# Altium project SensorProject.PrjPcb
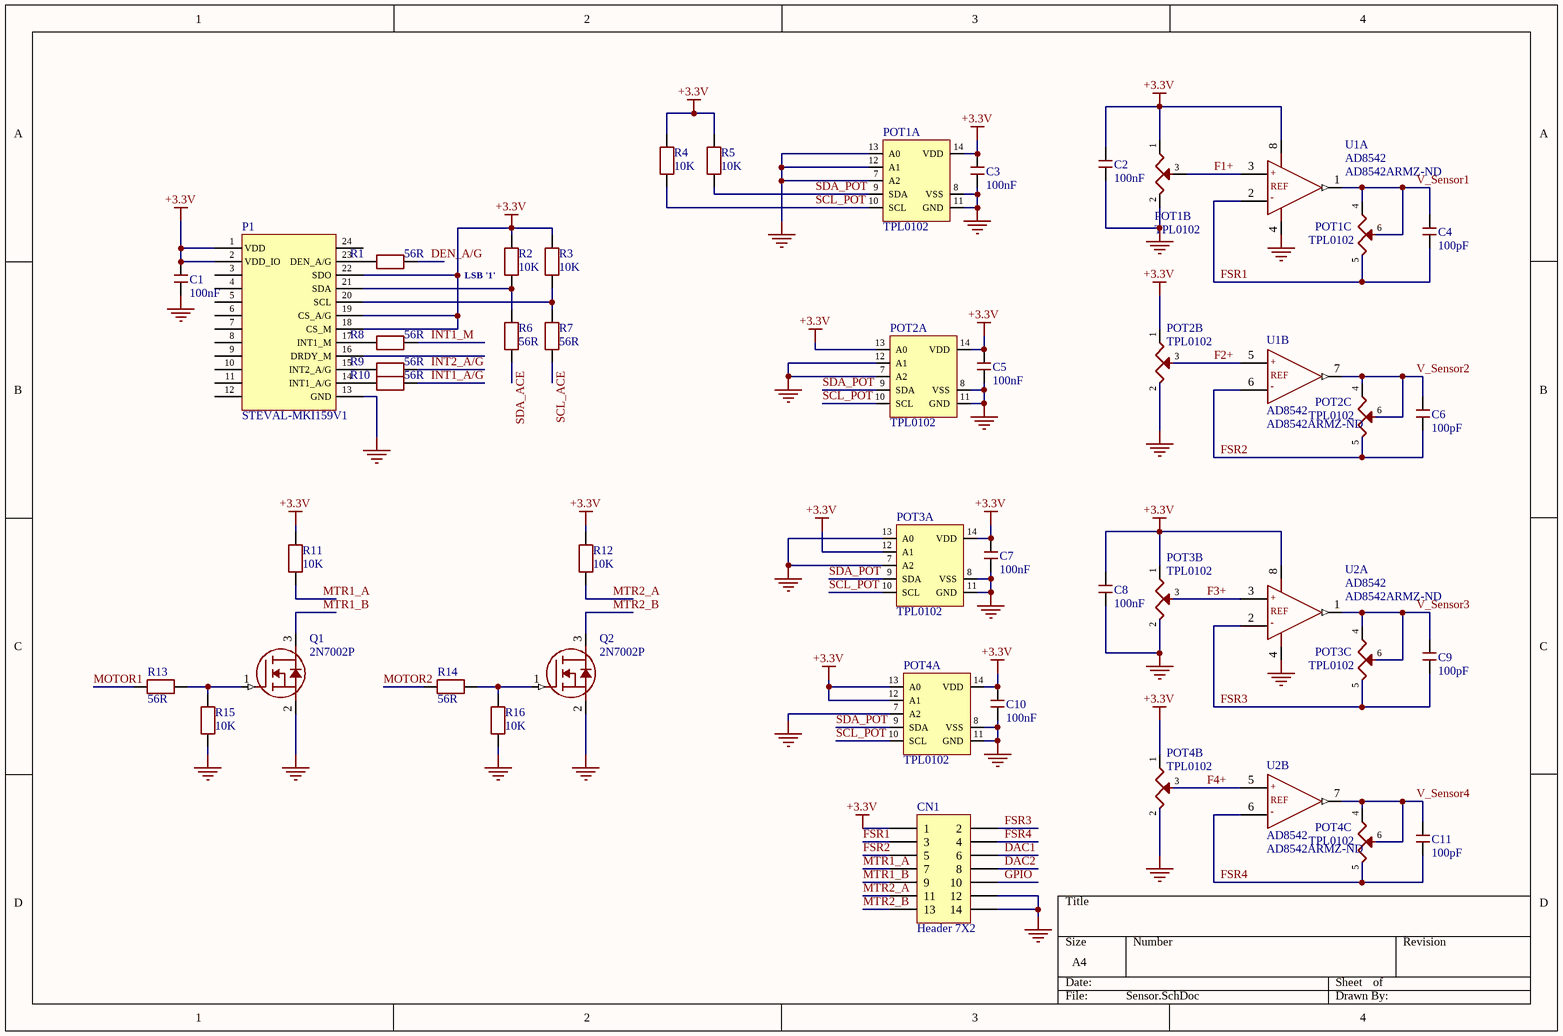
[diagram p0: Sensor.SchDoc]
2 sheets, 110 parts. Net scope: global (net labels, ports and power ports of the same name join across sheets).
Board file: PCB_REVA.PcbDoc
Sheets:
  Sensor.SchDoc
  uC.SchDoc

## Sheet Sensor.SchDoc
size A4

### Parts
C1  100nF  [CAP0805[2012]MD-BO]
C2  100nF  [CAP0805[2012]MD-BO]
C3  100nF  [CAP0805[2012]MD-BO]
C4  100pF  [CAP0805[2012]MD-BO]
C5  100nF  [CAP0805[2012]MD-BO]
C6  100pF  [CAP0805[2012]MD-BO]
C7  100nF  [CAP0805[2012]MD-BO]
C8  100nF  [CAP0805[2012]MD-BO]
C9  100pF  [CAP0805[2012]MD-BO]
C10  100nF  [CAP0805[2012]MD-BO]
C11  100pF  [CAP0805[2012]MD-BO]
CN1  Header 7X2  [HDR2X7]
P1  STEVAL-MKI159V1  [STEVAL-MKI159V1 (2)]
POT1  TPL0102  [TPL0102]  (parts A,B,C of 3)
POT2  TPL0102  [TPL0102]  (parts A,B,C of 3)
POT3  TPL0102  [TPL0102]  (parts A,B,C of 3)
POT4  TPL0102  [TPL0102]  (parts A,B,C of 3)
Q1  2N7002P  [SOT23-3]
Q2  2N7002P  [SOT23-3]
R1  56R  [RES0805[2012]MD-BO]
R2  10K  [RES0805[2012]MD]
R3  10K  [RES0805[2012]MD]
R4  10K  [RES0805[2012]MD]
R5  10K  [RES0805[2012]MD]
R6  56R  [RES0805[2012]MD-BO]
R7  56R  [RES0805[2012]MD-BO]
R8  56R  [RES0805[2012]MD-BO]
R9  56R  [RES0805[2012]MD-BO]
R10  56R  [RES0805[2012]MD-BO]
R11  10K  [RES0805[2012]MD-BO]
R12  10K  [RES0805[2012]MD-BO]
R13  56R  [RES0805[2012]MD-BO]
R14  56R  [RES0805[2012]MD-BO]
R15  10K  [RES0805[2012]MD-BO]
R16  10K  [RES0805[2012]MD-BO]
U1  AD8542  Supplier Part Number 1: AD8542ARMZ-ND  [MSOP8]  (parts A,B of 2)
U2  AD8542  Supplier Part Number 1: AD8542ARMZ-ND  [MSOP8]  (parts A,B of 2)

### Nets
+3.3V: C1.1 C2.1 C3.1 C5.1 C7.1 C8.1 C10.1 CN1.1 P1.1(VDD) P1.2(VDD_IO) P1.18(CS_M) P1.19(CS_A/G) P1.22(SDO) POT1.1(HA) POT1.14(VDD) POT2.1(HA) POT2.13(A0) POT2.14(VDD) POT3.1(HA) POT3.12(A1) POT3.14(VDD) POT4.1(HA) POT4.12(A1) POT4.13(A0) POT4.14(VDD) R2.2 R3.2 R4.2 R5.2 R11.2 R12.2 U1.8(V+) U2.8(V+)
GND: C1.2 C2.2 C3.2 C5.2 C7.2 C8.2 C10.2 CN1.12 CN1.14 P1.13(GND) POT1.2(LA) POT1.7(A2) POT1.8(VSS) POT1.11(GND) POT1.12(A1) POT1.13(A0) POT2.2(LA) POT2.7(A2) POT2.8(VSS) POT2.11(GND) POT2.12(A1) POT3.2(LA) POT3.7(A2) POT3.8(VSS) POT3.11(GND) POT3.13(A0) POT4.2(LA) POT4.7(A2) POT4.8(VSS) POT4.11(GND) Q1.2(SOURCE) Q2.2(SOURCE) R15.1 R16.1 U1.4(V-) U2.4(V-)
DAC1: CN1.6
DAC2: CN1.8
DEN_A/G: R1.1
F1+: POT1.3(WA) U1.3(+IN_A)
F2+: POT2.3(WA) U1.5(+IN_B)
F3+: POT3.3(WA) U2.3(+IN_A)
F4+: POT4.3(WA) U2.5(+IN_B)
FSR1: C4.2 CN1.3 POT1.5(LB) U1.2(-IN_A)
FSR2: C6.2 CN1.5 POT2.5(LB) U1.6(-IN_B)
FSR3: C9.2 CN1.2 POT3.5(LB) U2.2(-IN_A)
FSR4: C11.2 CN1.4 POT4.5(LB) U2.6(-IN_B)
GPIO: CN1.10
INT1_A/G: R10.1
INT1_M: R8.1
INT2_A/G: R9.1
MOTOR1: R13.1
MOTOR2: R14.1
MTR1_A: CN1.7 R11.1
MTR1_B: CN1.9 Q1.3(DRAIN)
MTR2_A: CN1.11 R12.1
MTR2_B: CN1.13 Q2.3(DRAIN)
SCL_ACE: R7.2
SCL_POT: POT1.10(SCL) POT2.10(SCL) POT3.10(SCL) POT4.10(SCL) R4.1
SDA_ACE: R6.2
SDA_POT: POT1.9(SDA) POT2.9(SDA) POT3.9(SDA) POT4.9(SDA) R5.1
V_Sensor1: C4.1 POT1.4(HB) POT1.6(WB) U1.1(OUT_A)
V_Sensor2: C6.1 POT2.4(HB) POT2.6(WB) U1.7(OUT_B)
V_Sensor3: C9.1 POT3.4(HB) POT3.6(WB) U2.1(OUT_A)
V_Sensor4: C11.1 POT4.4(HB) POT4.6(WB) U2.7(OUT_B)
NetP1_14: P1.14(INT1_A/G) R10.2
NetP1_15: P1.15(INT2_A/G) R9.2
NetP1_17: P1.17(INT1_M) R8.2
NetP1_20: P1.20(SCL) R3.1 R7.1
NetP1_21: P1.21(SDA) R2.1 R6.1
NetP1_23: P1.23(DEN_A/G) R1.2
NetQ1_1: Q1.1(GATE) R13.2 R15.2
NetQ2_1: Q2.1(GATE) R14.2 R16.2

Not connected (* = marked no-connect by the designer): P1 3(NC) 4(NC) 5(NC) 6(NC) 7(NC) 8(NC) 9(NC) 10(NC) 11(NC) 12(NC) 16(DRDY_M) 24(NC)

### Notes on the sheet
- (near R2) LSB '1'
- (in symbol AD8542, part A) +; REF; -
- (in symbol AD8542, part B) +; REF; -

### Library data of the parts
C1-C3 C5 C7 C8 C10 = SMD 0805 100nF 50V 10% X7R: CERAMIC SMD 0805 100nF 50V 10% X7R; Manufacturer 1: Samsung Electro-Mechanics America, Inc.; Part Number 1: CL21B104KBFNNNG; Part Number 2: CL21B104KBCNNNC; Manufacturer 2: Samsung Electro-Mechanics America, Inc.; Part Number 3: 08055C104KAT2A; Manufacturer 3: AVX Corporation; Manufacturer 4: Kemet; Part Number 4: C0805C104K5RACTU; Manufacturer 5: Yageo; Part Number 5: CC0805KRX7R9BB104
C4 C6 C9 C11 = SMD 0805 100pF 50V 5% C0G: CERAMIC SMD 0805 100pF 50V 5% C0G; Manufacturer 1: Samsung Electro-Mechanics America, Inc.; Part Number 1: CL21C101JBANNNC; Part Number 2: GRM2165C1H101JA01D; Manufacturer 2: Murata Electronics North America; Part Number 3: CC0805JRNPO9BN101; Manufacturer 3: Yageo; Part Number 4: 08055A101JAT2A; Manufacturer 4: AVX Corporation; Part Number 5: C0805C101J5GACTU; Manufacturer 5: Kemet; Part Number 6: 500R15N101JV4T; Manufacturer 6: Johanson Dielectrics Inc.
CN1 = Header 7X2: Header, 7-Pin, Dual row; LatestRevisionDate: 17-Jul-2002; LatestRevisionNote: Re-released for DXP Platform.; Publisher: Altium Limited
P1 = STEVAL-MKI159V1: STEVAL-MKI159V1 MEMS; Supplier 1: Digi-Key; Supplier Part Number 1: 497-15392-ND
Q1 Q2 = 2N7002P,215: MOSFET N-CH 60V 360mA SOT23-3; Manufacturer 1: NXP; Part Number 1: 2N7002P,215
R1 R6-R10 R13 R14 = SMD 0805 56R 5% 0.125W: RESISTOR SMD 0805 56R 5% 0.125W; Manufacturer 1: Yageo; Part Number 1: RC0805JR-0756RL; Part Number 2: RC2012J560CS; Manufacturer 2: Samsung Electro-Mechanics America, Inc; Part Number 3: RMCF0805JT56R0; Manufacturer 3: Stackpole Electronics Inc; Part Number 4: MCR10ERTJ560; Manufacturer 4: Rohm Semiconductor; Part Number 5: ERJ-6GEYJ560V; Manufacturer 5: Panasonic Electronic Components
R2-R5 R11 R12 R15 R16 = SMD 0805 10K 5% 0.125W: RESISTOR SMD 0805 10K 5% 0.125W; Manufacturer 1: Yageo; Part Number 1: RC0805JR-0710KL; Part Number 2: RC2012J103CS; Manufacturer 2: Samsung Electro-Mechanics America, Inc; Part Number 3: RMCF0805JT10K0; Manufacturer 3: Stackpole Electronics Inc; Part Number 4: MCR10ERTJ103; Manufacturer 4: Rohm Semiconductor
POT1-POT4 = TPL0102: Supplier 1: Digi-Key; Supplier Part Number 1: 296-30048-2-ND
U1 U2 = AD8542: Supplier 1: Digi-Key

## Sheet uC.SchDoc
size A4
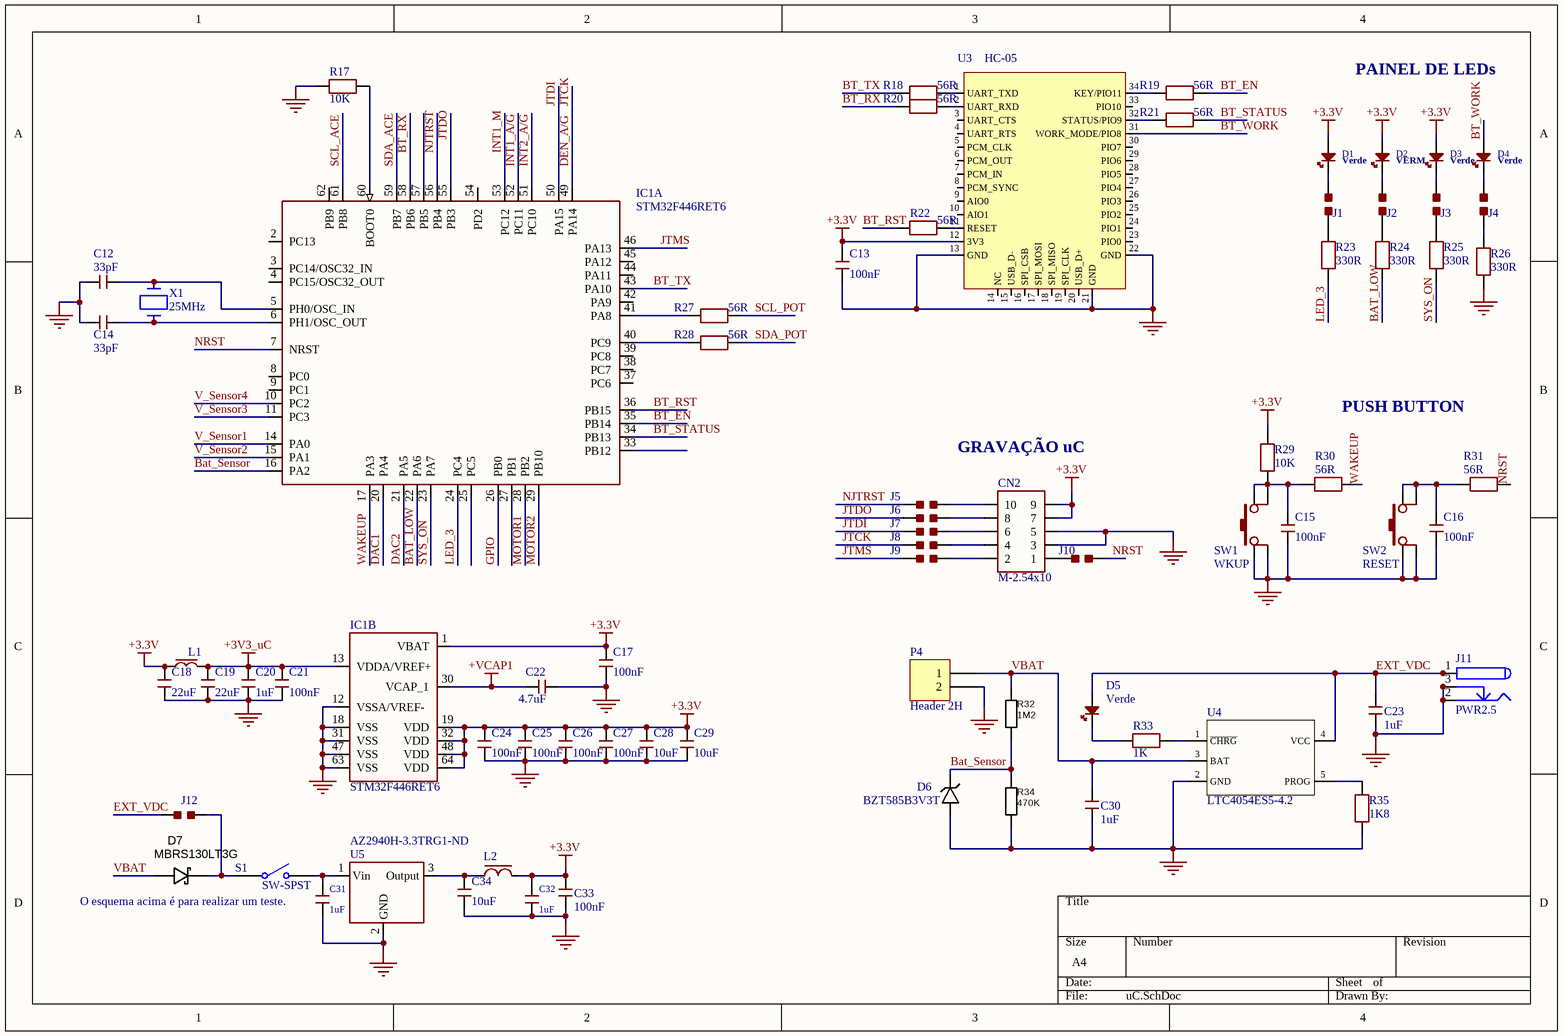
[diagram p1: uC.SchDoc]

### Parts
C12  33pF  [CAP0805[2012]MD-BO]
C13  100nF  [CAP0805[2012]MD-BO]
C14  33pF  [CAP0805[2012]MD-BO]
C15  100nF  [CAP0805[2012]MD-BO]
C16  100nF  [CAP0805[2012]MD-BO]
C17  100nF  [CAP0805[2012]MD-BO]
C18  22uF  [CAP0805[2012]MD-BO]
C19  22uF  [CAP0805[2012]MD-BO]
C20  1uF  [CAP0805[2012]MD-BO]
C21  100nF  [CAP0805[2012]MD-BO]
C22  4.7uF  [CAP0805[2012]MD-BO]
C23  1uF  [CAP0805[2012]MD-BO]
C24  100nF  [CAP0805[2012]MD-BO]
C25  100nF  [CAP0805[2012]MD-BO]
C26  100nF  [CAP0805[2012]MD-BO]
C27  100nF  [CAP0805[2012]MD-BO]
C28  10uF  [CAP0805[2012]MD-BO]
C29  10uF  [CAP0805[2012]MD-BO]
C30  1uF  [CAP0805[2012]MD-BO]
C31  1uF  [CAP0805[2012]MD-BO]
C32  1uF  [CAP0805[2012]MD-BO]
C33  100nF  [CAP0805[2012]MD-BO]
C34  10uF  [CAP1206[3216]MD]
CN2  M-2.54x10  [HDR-M-10P-2R-UNS_P2.54xW2.54xH6]
D1  Verde  [LEDP0805YELLOW]
D2  VERM  [LEDP0805YELLOW]
D3  Verde  [LEDP0805YELLOW]
D4  Verde  [LEDP0805YELLOW]
D5  Verde  [LEDP0805GREEN]
D6  BZT585B3V3T  [SOD523F]
D7  MBRS130LT3G  [DO-214AA]
IC1  STM32F446RET6  [LQFP64MD]  (parts A,B of 2)
J1  0R  [JP0202[0505]MD]  (value not drawn)  (no BOM)
J2  0R  [JP0202[0505]MD]  (value not drawn)  (no BOM)
J3  0R  [JP0202[0505]MD]  (value not drawn)  (no BOM)
J4  0R  [JP0202[0505]MD]  (value not drawn)  (no BOM)
J5  0R  [JP0202[0505]MD]  (value not drawn)  (no BOM)
J6  0R  [JP0202[0505]MD]  (value not drawn)  (no BOM)
J7  0R  [JP0202[0505]MD]  (value not drawn)  (no BOM)
J8  0R  [JP0202[0505]MD]  (value not drawn)  (no BOM)
J9  0R  [JP0202[0505]MD]  (value not drawn)  (no BOM)
J10  0R  [JP0202[0505]MD]  (value not drawn)  (no BOM)
J11  PWR2.5  [CONECTOR_PJ]
J12  0R  [JP0202[0505]MD]  (value not drawn)  (no BOM)
L1  BLM21RK102SN1  [IND0805[2012]MD]  (value not drawn)
L2  BLM21AG601SN1D  [IND0805[2012]MD]  (value not drawn)
P4  Header 2H  [HDR1X2H]
R17  10K  [RES0805[2012]MD]
R18  56R  [RES0805[2012]MD-BO]
R19  56R  [RES0805[2012]MD-BO]
R20  56R  [RES0805[2012]MD-BO]
R21  56R  [RES0805[2012]MD-BO]
R22  56R  [RES0805[2012]MD-BO]
R23  330R  [RES0805[2012]MD-BO]
R24  330R  [RES0805[2012]MD-BO]
R25  330R  [RES0805[2012]MD-BO]
R26  330R  [RES0805[2012]MD-BO]
R27  56R  [RES0805[2012]MD-BO]
R28  56R  [RES0805[2012]MD-BO]
R29  10K  [RES0805[2012]MD-BO]
R30  56R  [RES0805[2012]MD-BO]
R31  56R  [RES0805[2012]MD-BO]
R32  1M2  [RES0805[2012]MD]
R33  1K  [RES0805[2012]MD]
R34  470K  [RES0805[2012]MD]
R35  1K8  [RES0805[2012]MD]
S1  SW-SPST  [SWITCH]
SW1  WKUP  [TACSW1PSMD4_6x6x4.5]
SW2  RESET  [TACSW1PSMD4_6x6x4.5]
U3  HC-05  [HC-05]
U4  LTC4054ES5-4.2  [5-LEAD TSOT-23 - duplicate2]
U5  AZ2940H-3.3TRG1-ND  [SOT223MD]
X1  25MHz  [ABM3-8.000MHZ-D2Y-T]

### Nets
+3.3V: C13.1 C17.1 C18.1 C24.1 C25.1 C26.1 C27.1 C28.1 C29.1 C32.1 C33.1 CN2.7 CN2.9 D1.2(A) D2.2(A) D3.2(A) IC1.1(VBAT) IC1.19(VDD) IC1.32(VDD) IC1.48(VDD) IC1.64(VDD) L1.1 L2.2 R29.2 U3.12(3V3)
+3V3_uC: C19.1 C20.1 C21.1 IC1.13(VDDA/VREF+) L1.2
+VCAP1: C22.1 IC1.30(VCAP_1)
GND: C12.1 C13.2 C14.1 C15.2 C16.2 C17.2 C18.2 C19.2 C20.2 C21.2 C22.2 C23.2 C24.2 C25.2 C26.2 C27.2 C28.2 C29.2 C30.2 C31.2 C32.2 C33.2 C34.2 CN2.3 CN2.5 D6.A IC1.12(VSSA/VREF-) IC1.18(VSS) IC1.31(VSS) IC1.47(VSS) IC1.63(VSS) J11.2 J11.2A J11.2B J11.3 J11.3A J11.3B P4.2 R17.1 R26.1 R34.1 R35.1 SW1.1 SW1.2 SW2.1 SW2.2 U3.13(GND) U3.21(GND) U3.22(GND) U4.2(GND) U5.2(GND) U5.4(GND)
BAT_LOW: IC1.22(PA6) R24.1
Bat_Sensor: D6.K IC1.16(PA2) R32.1 R34.2
BT_EN: IC1.35(PB14) R19.2
BT_RST: IC1.36(PB15) R22.1
BT_RX: IC1.58(PB6) R20.1
BT_STATUS: IC1.34(PB13) R21.2
BT_TX: IC1.43(PA10) R18.1
BT_WORK: D4.2(A) U3.31(WORK_MODE/PIO8)
DAC1: IC1.20(PA4)
DAC2: IC1.21(PA5)
DEN_A/G: IC1.49(PA14) J8.1  [also labelled JTCK]
EXT_VDC: C23.1 D5.2(A) J11.1 J11.1A J11.1B J12.1 U4.4(VCC)
GPIO: IC1.26(PB0)
INT1_A/G: IC1.52(PC11)
INT1_M: IC1.53(PC12)
INT2_A/G: IC1.51(PC10)
JTDI: IC1.50(PA15) J7.1
JTDO: IC1.55(PB3) J6.1
JTMS: IC1.46(PA13) J9.1
LED_3: IC1.24(PC4) R23.1
MOTOR1: IC1.28(PB2)
MOTOR2: IC1.29(PB10)
NJTRST: IC1.56(PB4) J5.1
NRST: IC1.7(NRST) J10.2 R31.1
SCL_ACE: IC1.61(PB8)
SCL_POT: R27.1
SDA_ACE: IC1.59(PB7)
SDA_POT: R28.1
SYS_ON: IC1.23(PA7) R25.1
V_Sensor1: IC1.14(PA0)
V_Sensor2: IC1.15(PA1)
V_Sensor3: IC1.11(PC3)
V_Sensor4: IC1.10(PC2)
VBAT: C30.1 D7.A P4.1 R32.2 U4.3(BAT)
WAKEUP: IC1.17(PA3) R30.2
NetC12_2: C12.2 IC1.5(PH0/OSC_IN) X1.2
NetC14_2: C14.2 IC1.6(PH1/OSC_OUT) X1.1
NetC15_1: C15.1 R29.1 R30.1 SW1.3 SW1.4
NetC16_1: C16.1 R31.2 SW2.3 SW2.4
NetC31_1: C31.1 S1.2(NO) U5.1(Vin)
NetC34_1: C34.1 L2.1 U5.3(Output)
NetCN2_1: CN2.1 J10.1
NetCN2_2: CN2.2 J9.2
NetCN2_4: CN2.4 J8.2
NetCN2_6: CN2.6 J7.2
NetCN2_8: CN2.8 J6.2
NetCN2_10: CN2.10 J5.2
NetD1_1: D1.1(K) J1.2
NetD2_1: D2.1(K) J2.2
NetD3_1: D3.1(K) J3.2
NetD4_1: D4.1(K) J4.2
NetD5_1: D5.1(K) R33.2
NetD7_K: D7.K J12.2 S1.1(COMMON)
NetIC1_40: IC1.40(PC9) R28.2
NetIC1_41: IC1.41(PA8) R27.2
NetIC1_60: IC1.60(BOOT0) R17.2
NetJ1_1: J1.1 R23.2
NetJ2_1: J2.1 R24.2
NetJ3_1: J3.1 R25.2
NetJ4_1: J4.1 R26.2
NetR18_2: R18.2 U3.1(UART_TXD)
NetR19_1: R19.1 U3.34(KEY/PIO11)
NetR20_2: R20.2 U3.2(UART_RXD)
NetR21_1: R21.1 U3.32(STATUS/PIO9)
NetR22_2: R22.2 U3.11(RESET)
NetR33_1: R33.1 U4.1(~{CHRG})
NetR35_2: R35.2 U4.5(PROG)

Not connected (* = marked no-connect by the designer): IC1 2(PC13) 3(PC14/OSC32_IN) 4(PC15/OSC32_OUT) 8(PC0) 9(PC1) 25(PC5) 27(PB1) 33(PB12) 37(PC6) 38(PC7) 39(PC8) 42(PA9) 44(PA11) 45(PA12) 54(PD2) 57(PB5) 62(PB9); U3 3(UART_CTS) 4(UART_RTS) 5(PCM_CLK) 6(PCM_OUT) 7(PCM_IN) 8(PCM_SYNC) 9(AIO0) 10(AIO1) 14(NC) 15(USB_D-) 16(SPI_CSB) 17(SPI_MOSI) 18(SPI_MISO) 19(SPI_CLK) 20(USB_D+) 23(PIO0) 24(PIO1) 25(PIO2) 26(PIO3) 27(PIO4) 28(PIO5) 29(PIO6) 30(PIO7) 33(PIO10)

### Notes on the sheet
- PAINEL DE LEDs
- PUSH BUTTON
- GRAVAÇÃO uC
- (near C31) O esquema acima é para realizar um teste.

### Library data of the parts
C12 C14 = SMD 0805 33pF 50V 5% C0G: CERAMIC SMD 0805 33pF 50V 5% C0G; Manufacturer 1: Johanson Dielectrics Inc; Part Number 1: 500R15N330JV4T; Part Number 2: CL21C330JBANNNC; Manufacturer 2: Samsung Electro-Mechanics America, Inc; Part Number 3: CL21C330JBANFNC; Manufacturer 3: Samsung Electro-Mechanics America, Inc; Part Number 4: C0805C330J5GACTU; Manufacturer 4: Kemet; Part Number 5: CC0805JRNPO9BN330; Manufacturer 5: Yageo; Part Number 6: 08055A330JAT2A; Manufacturer 6: AVX Corporation
C13 C15-C17 C21 C24-C27 C33 = SMD 0805 100nF 50V 10% X7R: as C1 on sheet Sensor; Part Number 2: CL21B104KBCNNNC; Manufacturer 2: Samsung Electro-Mechanics America, Inc.; Part Number 3: 08055C104KAT2A; Manufacturer 3: AVX Corporation; Manufacturer 4: Kemet; Part Number 4: C0805C104K5RACTU; Manufacturer 5: Yageo; Part Number 5: CC0805KRX7R9BB104
C18 C19 = SMD 0805 22uF 10V 20% X5R: CERAMIC SMD 0805 22uF 10V 20% X5R; Manufacturer 1: Murata Electronics North America; Part Number 1: GRM21BR61A226ME51L; Part Number 2: CC0805MKX5R6BB226; Manufacturer 2: Yageo; Part Number 3: GRM219R61A226MEA0D; Manufacturer 3: Murata Electronics North America; Part Number 4: C2012X5R1A226M125AB; Manufacturer 4: TDK Corporation; Part Number 5: CL21A226MPQNNNE; Manufacturer 5: Samsung Electro-Mechanics America, Inc; Part Number 6: LMK212BJ226MG-T; Manufacturer 6: Taiyo Yuden; Part Number 7: 0805ZD226MAT2A; Manufacturer 7: AVX Corporation
C20 C23 C30-C32 = SMD 0805 1uF 50V 10% X7R: CERAMIC SMD 0805 1uF 50V 10% X7R; Part Number 1: UMK212B7105KG-T; Manufacturer 1: Taiyo Yuden; Part Number 2: CL21B105KBFNNNE; Manufacturer 2: Samsung Electro-Mechanics America, Inc; Part Number 3: C2012X7R1H105K085AC; Manufacturer 3: TDK Corporation; Part Number 4: C0805C105K5RACTU; Manufacturer 4: Kemet
C22 = SMD 0805 4.7uF 10V 10% X5R: CERAMIC SMD 0805 4.7uF 10V 10% X5R; Part Number 1: CL21A475KPFNNNG; Manufacturer 1: Samsung Electro-Mechanics America, Inc.; Manufacturer 2: Yageo; Part Number 2: CC0805KKX5R6BB475; Part Number 3: CL21A475KPFNNNE; Manufacturer 3: Samsung Electro-Mechanics America, Inc.; Manufacturer 4: Murata Electronics North America; Part Number 4: GRM219R61A475KE34D; Manufacturer 5: Taiyo Yuden; Part Number 5: LMK212BJ475KD-T
C28 C29 = SMD 0805 10uF 10V 10% X7R: CERAMIC SMD 0805 10uF 10V 10% X7R; Part Number 1: GRM21BR71A106KA73L; Manufacturer 1: Murata Electronics North America; Part Number 2: CL21B106KPQNNNE; Manufacturer 2: Samsung Electro-Mechanics America, Inc; Part Number 3: LMK212B7106KG-TD; Manufacturer 3: Taiyo Yuden; Part Number 4: GRM21BR71A106KE51L; Manufacturer 4: Murata Electronics North America; Part Number 5: C2012X7R1A106K125AC; Manufacturer 5: TDK Corporation
C34 = SMD 1206 10uF 35V 10% X7R: CERAMIC SMD 1206 10uF 35V 10% X7R; Part Number 1: GMK316AB7106KL-TR; Manufacturer 1: Taiyo Yuden; Manufacturer 2: TDK; Part Number 2: C3216X7R1V106K160AC; Part Number 3: CL31B106KLHNNNE; Manufacturer 3: Samsung
CN2 = HDR M UNSH 10P 2R 2.54MM 6MM: HEADER MALE UNSHROUDED 10P 2ROW 2.54MM 6MM; Part Number 1: M20-9760546; Manufacturer 1: Harwin Inc; Manufacturer 2: Sullins; Part Number 2: PREC005DAAN-RC; Manufacturer 3: FCI; Part Number 3: 67997-410HLF
D1-D4 = LED AMARELO SMD 0805 Vf 2V DIFF: LED AMARELO SMD 0805 DIF; Part Number 1: LY R976-PS-36; Manufacturer 1: OSRAM Opto Semiconductors Inc
D5 = LED VERDE SMD 0805 Vf  2,2 V DIFF: LED VERDE SMD 0805 DIF; Part Number 1: APT2012SGC; Manufacturer 1: Kingbright Company LLC
D6 = BZT585B3V3: BZT585B3V3T-7DICT-ND; Supplier 1: Digi-Key; Supplier Part Number 1: BZT585B3V3T-7DICT-ND
D7 = DIODE_SCHOTTKY_MBRS130L: Diode Schottky SMD 30V 2A DO-214AA; Manufacturer 1: Fairchild Semiconductor; Material: Si; Ratings: 30Vr; 2A; SCDType: source; Package / Case: DO-214AA, SMB; Supplier 1: Digi-Key; Supplier Part Number 1: MBRS130LFSCT-ND; Manufacturer Part Number 1: MBRS130L
IC1 = STM32F446RET6: IC MCU ARM M4 512KB FLASH 128K RAM LQFP64; Manufacturer 1: STMicroelectronics; Part Number 1: STM32F446RET6
J1-J10 J12 = SOLDER JUMP 1.5A 0202
J11 = PWR2.5: Low Voltage Power Supply Connector; Part Number: CP-002A-ND; Published: 17-Dec-2003; DatasheetDocument: 09-May-2002; Publisher: Altium Limited; ComponentLink1Description: Manufacturer Link; ComponentLink1URL: http://domino.kycon.com/internet/Products.html
L1 = BLM21RK102SN1: Ferrite Bead 0805 1000R 100MHz 200mA 0.5R DC; Manufacturer 1: Murata; Part Number 1: BLM21RK102SN1
L2 = BLM21AG601SN1D: FERRITE BEAD 600R@100MHz 210mRDC 600mA 0805; Manufacturer 1: Murata Electronics North America; Part Number 1: BLM21AG601SN1D
P4 = Header 2H: Header, 2-Pin, Right Angle; LatestRevisionDate: 17-Jul-2002; LatestRevisionNote: Re-released for DXP Platform.; Publisher: Altium Limited
R17 R29 = SMD 0805 10K 5% 0.125W: as R2 on sheet Sensor; Part Number 2: RC2012J103CS; Manufacturer 2: Samsung Electro-Mechanics America, Inc; Part Number 3: RMCF0805JT10K0; Manufacturer 3: Stackpole Electronics Inc; Part Number 4: MCR10ERTJ103; Manufacturer 4: Rohm Semiconductor
R18-R22 R27 R28 R30 R31 = SMD 0805 56R 5% 0.125W: as R1 on sheet Sensor; Part Number 2: RC2012J560CS; Manufacturer 2: Samsung Electro-Mechanics America, Inc; Part Number 3: RMCF0805JT56R0; Manufacturer 3: Stackpole Electronics Inc; Part Number 4: MCR10ERTJ560; Manufacturer 4: Rohm Semiconductor; Part Number 5: ERJ-6GEYJ560V; Manufacturer 5: Panasonic Electronic Components
R23-R26 = SMD 0805 330R 5% 0.125W: RESISTOR SMD 0805 330R 5% 0.125W; Manufacturer 1: Yageo; Part Number 1: RC0805JR-07330RL; Part Number 2: RC2012J331CS; Manufacturer 2: Samsung Electro-Mechanics America, Inc; Part Number 3: RMCF0805JT330R; Manufacturer 3: Stackpole Electronics Inc; Part Number 4: MCR10ERTJ331; Manufacturer 4: Rohm Semiconductor; Part Number 5: ERJ-6GEYJ331V; Manufacturer 5: Panasonic Electronic Components
R32 R34 = RES_10K_0805_5%: Resistor SMD chip 10k Ohm 0.125W 5% 0805; Manufacturer 1: Yageo; Manufacturer Part Number 1: RC0805JR-0710KL; Ratings: 1/8 W; SCDType: spec; Package / Case: 0805 (2012 metric); Tolerance: ±5%; Material: Thick Film; Supplier 1: Digi-Key; Supplier Part Number 1: 311-10KARCT-ND
  R32: Value: 1M2
  R34: Value: 470K
R33 = SMD 0805 1K 5% 0.125W: RESISTOR SMD 0805 1K 5% 0.125W; Manufacturer 1: Yageo; Part Number 1: RC0805JR-071KL; Part Number 2: RC2012J102CS; Manufacturer 2: Samsung Electro-Mechanics America, Inc; Part Number 3: RMCF0805JT1K00; Manufacturer 3: Stackpole Electronics Inc; Part Number 4: MCR10ERTJ102; Manufacturer 4: Rohm Semiconductor
R35 = SMD 0805 1K8 5% 0.125W: RESISTOR SMD 0805 1K8 5% 0.125W; Manufacturer 1: Yageo; Part Number 1: RC0805JR-071K8L
S1 = SW-SPST: Single-Pole, Single-Throw Switch; Published: 24-Mar-1999; LatestRevisionDate: 17-Jul-2002; LatestRevisionNote: Re-released for DXP Platform.; PackageReference: SPST-2; Publisher: Altium Limited; PackageDescription: Switch; 2 Leads
SW1 SW2 = TAC SWITCH 1P SPST-NO 0.05A 24V 4.3mm SMD: Manufacturer 1: TE Connectivity; Part Number 1: 2-1437565-9
U3 = HC-05: Master/Slave Bluetooth Serial Module; Part Number: HC-05
X1 = ABM3-8.000MHZ-D2Y-T: 8MHz ±20ppm Crystal 18pF 140 Ohm -40°C ~ 85°C Surface Mount 2-SMD
U4 = LTC4054ES5-4.2: Supplier 1: Digi-Key; Supplier Part Number 1: LTC4054ES5-4.2#TRMPBFCT-ND
U5 = AZ2940H-3.3TRG1-ND: Supplier 1: Digi-Key; Supplier Part Number 1: AZ2940H-3.3TRG1-ND

## Nets that join several sheets
+3.3V: Sensor (33 pins), uC (25 pins)
GND: Sensor (36 pins), uC (52 pins)
DAC1: Sensor (CN1.6), uC (IC1.20)
DAC2: Sensor (CN1.8), uC (IC1.21)
DEN_A/G: Sensor (R1.1), uC (IC1.49 J8.1)
GPIO: Sensor (CN1.10), uC (IC1.26)
INT1_A/G: Sensor (R10.1), uC (IC1.52)
INT1_M: Sensor (R8.1), uC (IC1.53)
INT2_A/G: Sensor (R9.1), uC (IC1.51)
MOTOR1: Sensor (R13.1), uC (IC1.28)
MOTOR2: Sensor (R14.1), uC (IC1.29)
SCL_ACE: Sensor (R7.2), uC (IC1.61)
SCL_POT: Sensor (5 pins), uC (R27.1)
SDA_ACE: Sensor (R6.2), uC (IC1.59)
SDA_POT: Sensor (5 pins), uC (R28.1)
V_Sensor1: Sensor (C4.1 POT1.4 POT1.6 U1.1), uC (IC1.14)
V_Sensor2: Sensor (C6.1 POT2.4 POT2.6 U1.7), uC (IC1.15)
V_Sensor3: Sensor (C9.1 POT3.4 POT3.6 U2.1), uC (IC1.11)
V_Sensor4: Sensor (C11.1 POT4.4 POT4.6 U2.7), uC (IC1.10)